# EAGLE board M.2 SoM breakout board v0.2-Placement-03011 (EAGLE 9.6.2), part 1 of 2
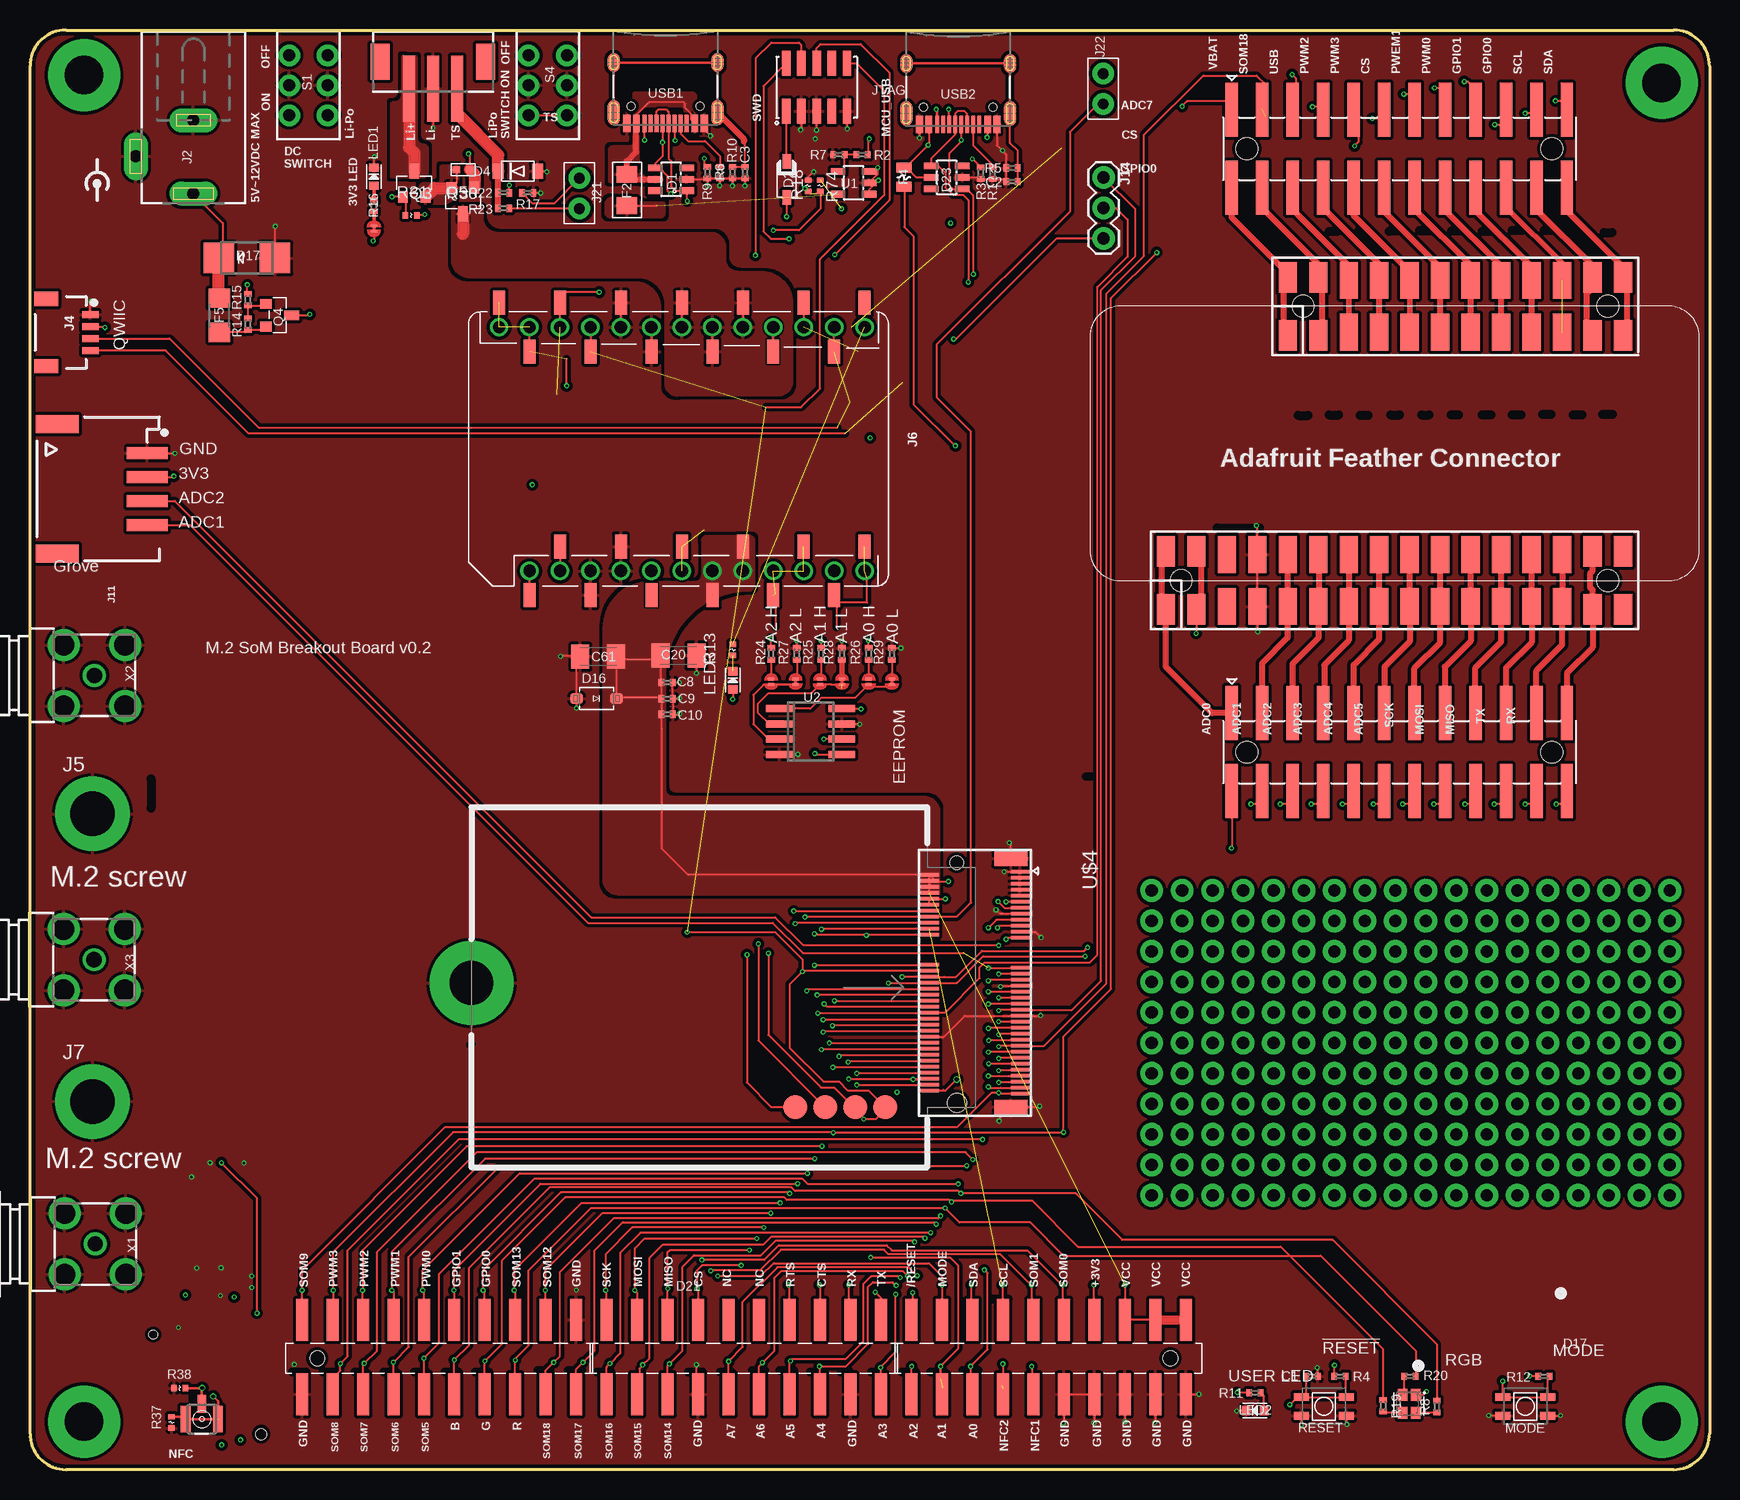
[diagram p3: board, top side]
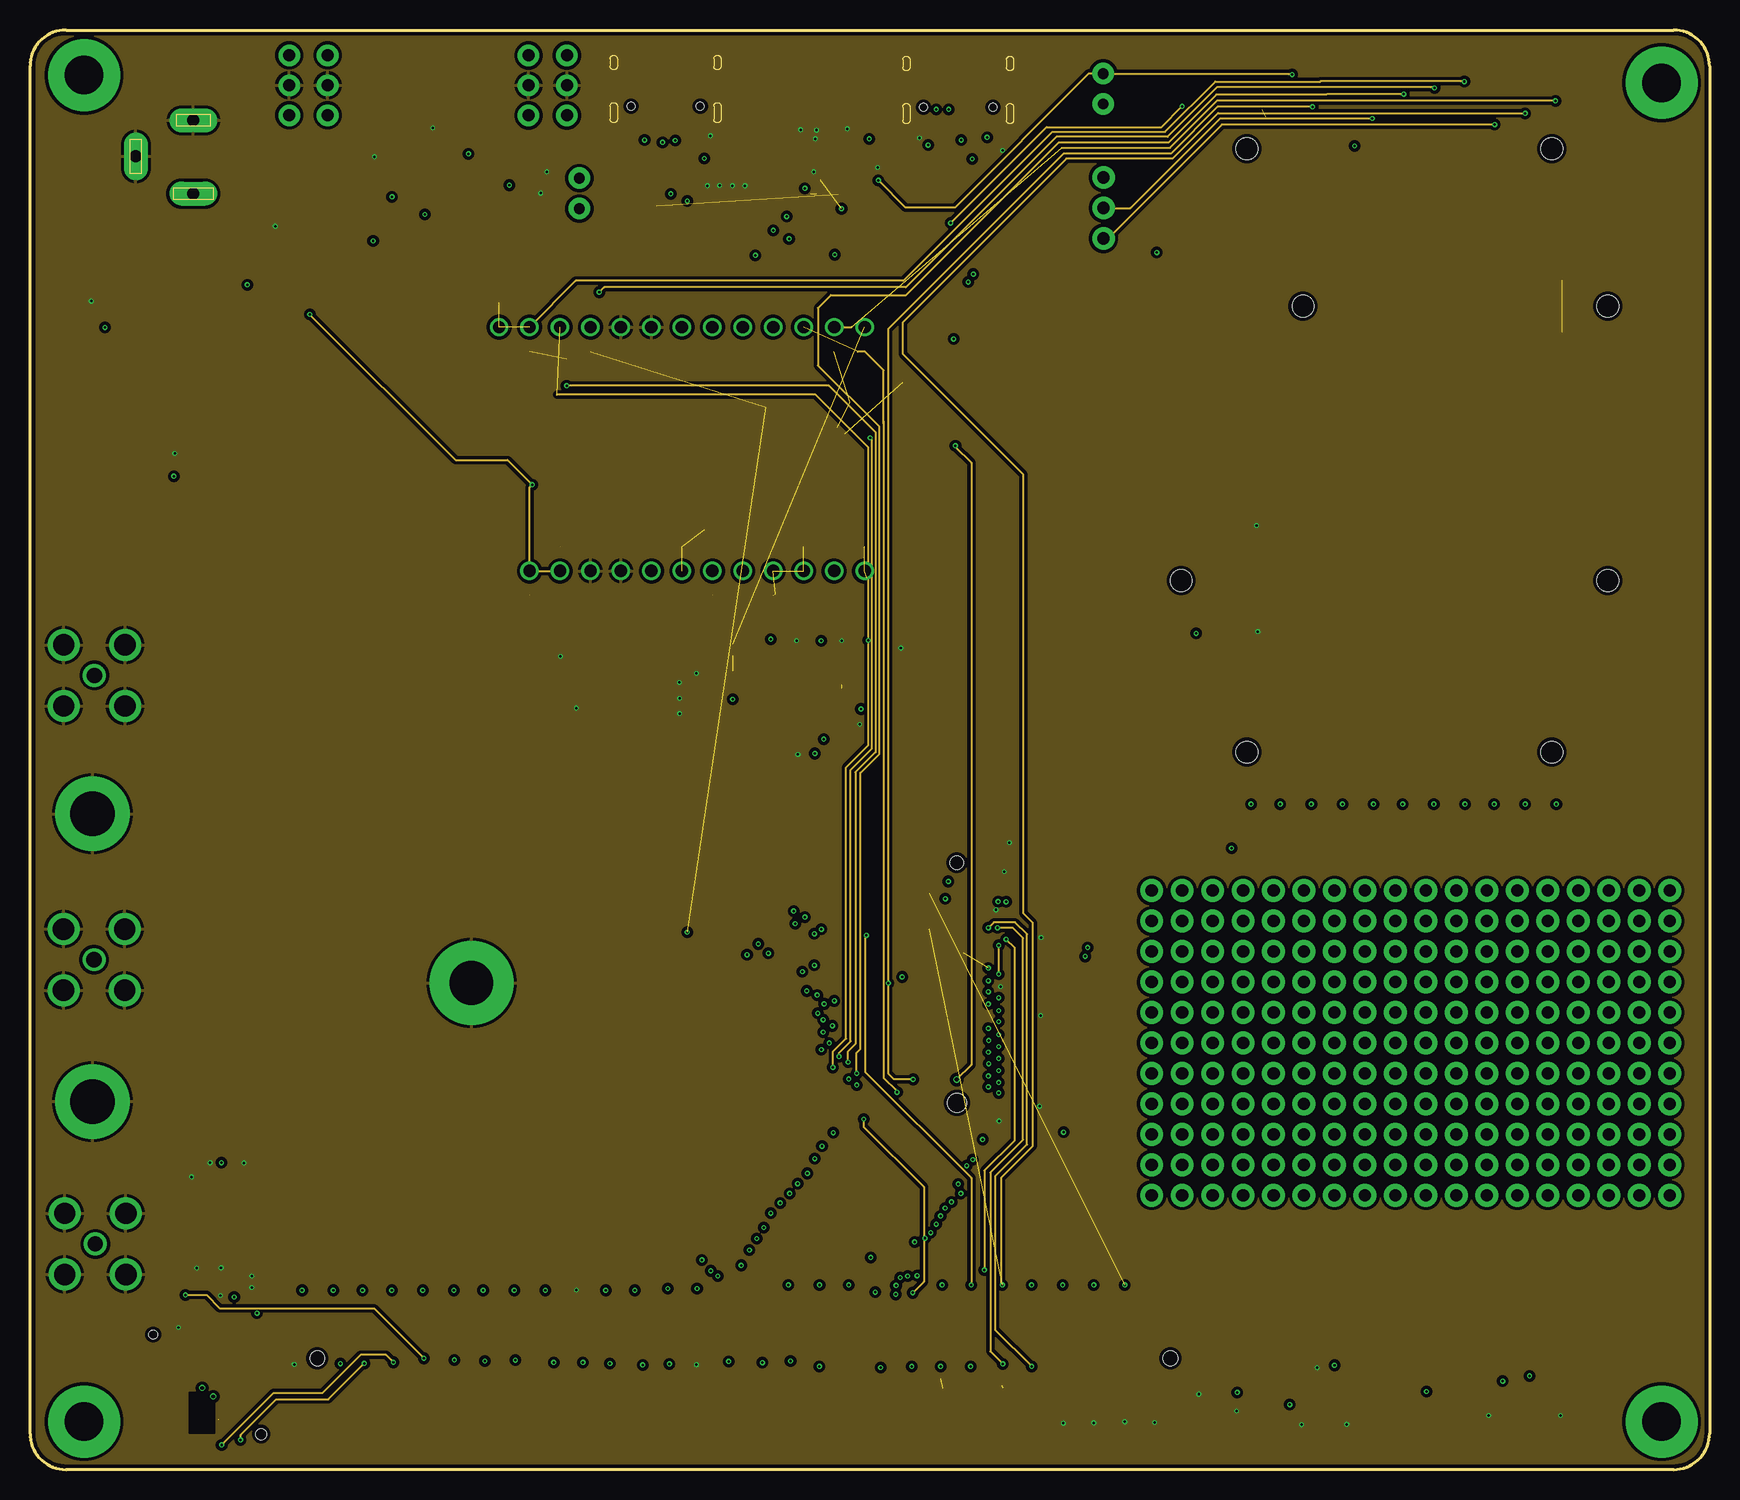
[diagram p4: board, inner layer GND]
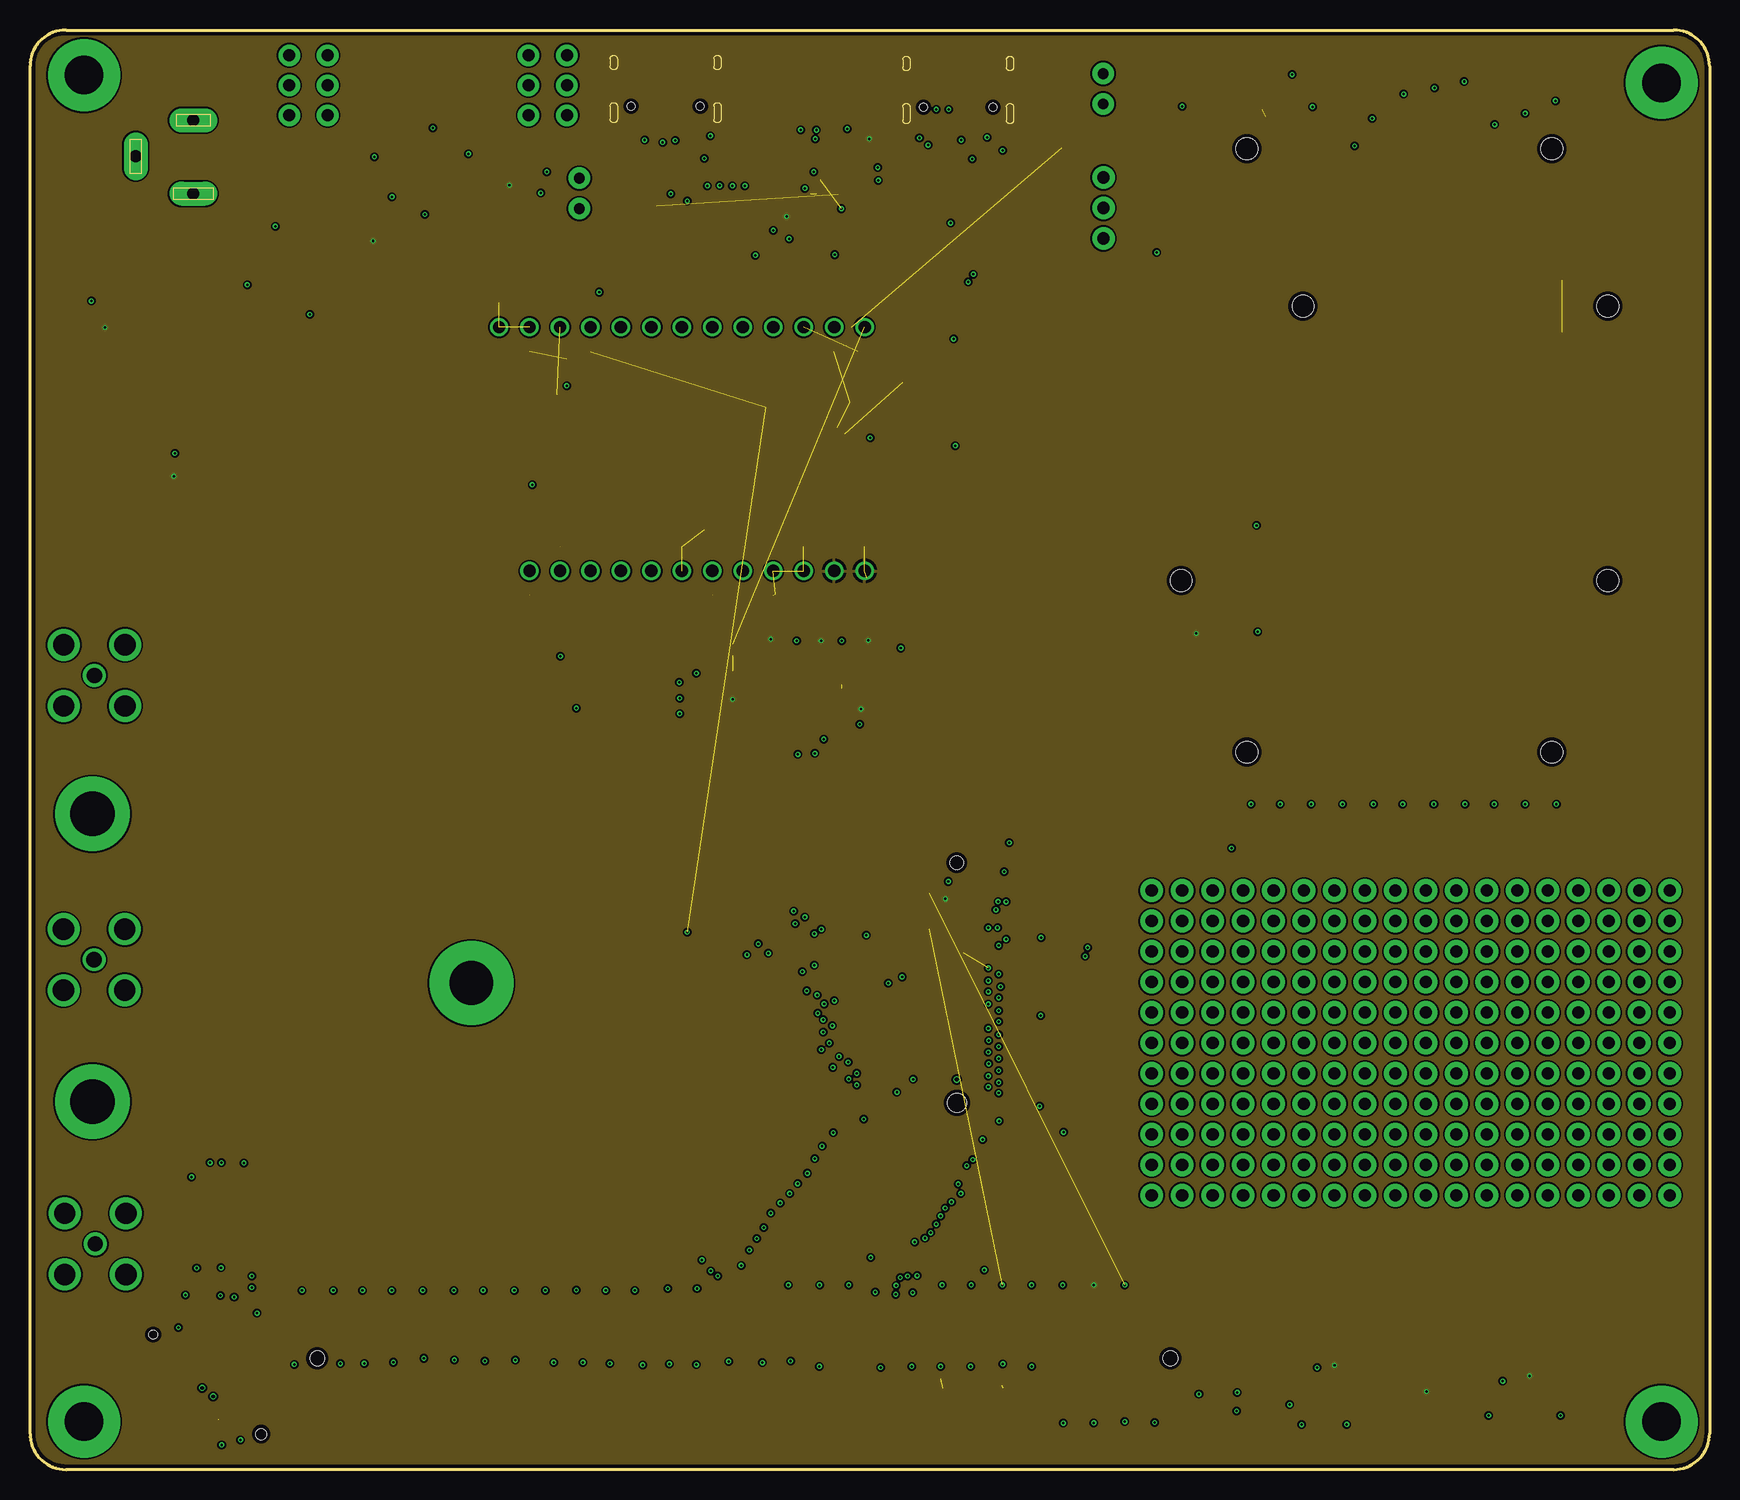
[diagram p5: board, inner layer Route15]
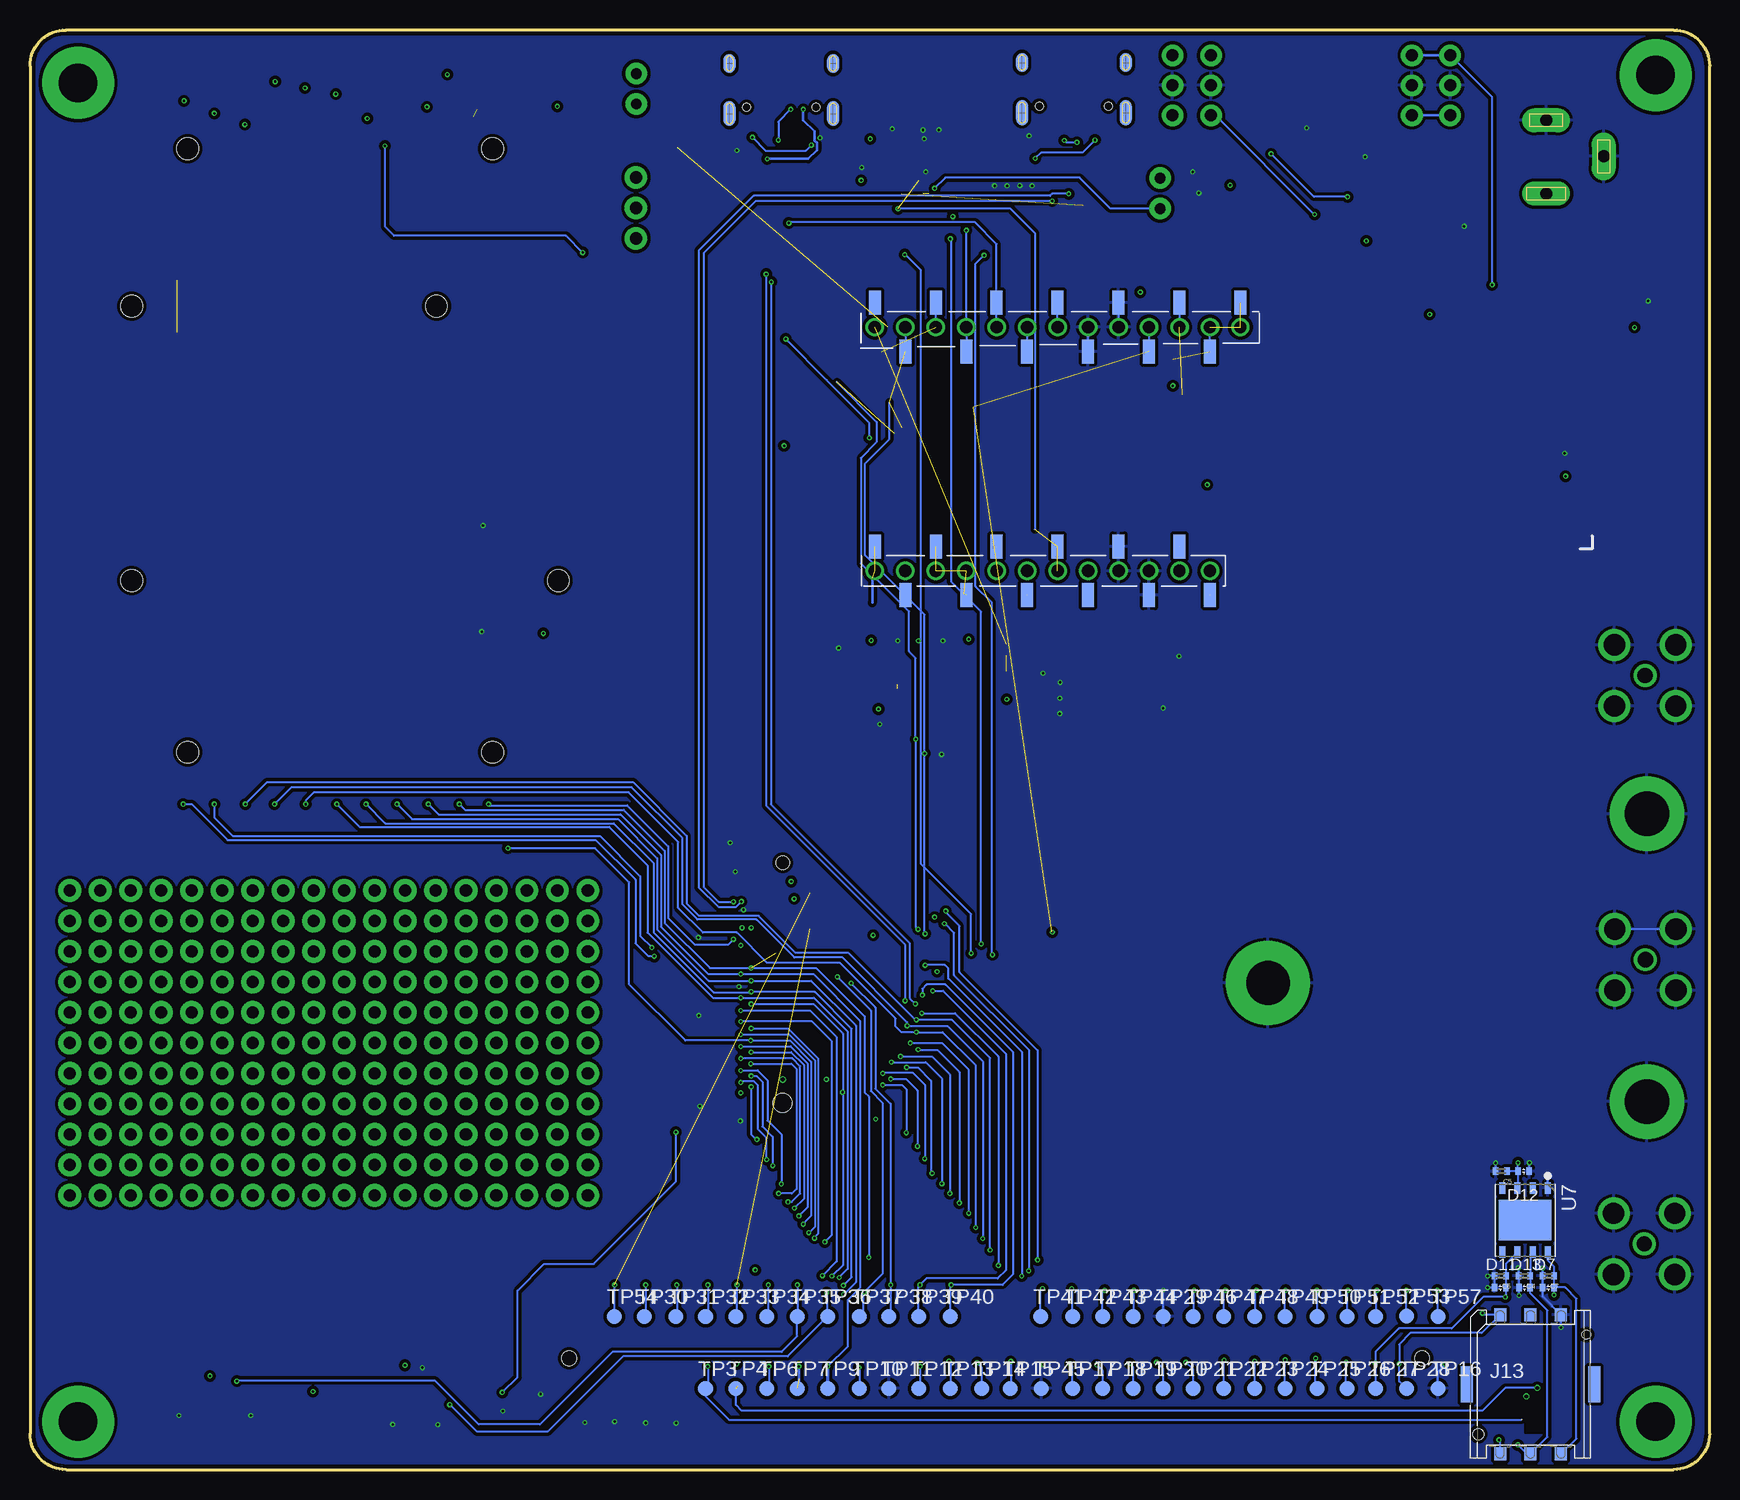
[diagram p6: board, bottom side, seen from below]

Size 140 x 120 mm. Coordinates in mm from the lower left corner, seen from the top.
Outline: 3,120 137,120 arc-90 140,117 140,3 arc-90 137,0 3,0 arc-90 0,3 0,117 arc-90 3,120
Copper layers (1+2*15+16): Top 0.035mm / dielectric 1.5mm / GND 0.035mm / dielectric 0.15mm / Route15 0.035mm / dielectric 0.2mm / Bottom 0.035mm
Design rules "default *": minimum track width 6mil, minimum drill 0.1mm, track to track 6mil, track to pad 6mil, pad to pad 6mil, via to via 6mil, smd to smd 6mil, copper to edge 12mil, drill to drill 6mil, minimum pad ring 4mil, minimum via ring 4mil, stop-mask expansion 4mil, vias tented up to drill 0.35mm, thermal gap 10mil
Net classes: 0 default: width 0.152 mm, clearance 0.152 mm; 1 power: width 0.254 mm, drill 0.61 mm, clearance 0.203 mm; 2 120R_Impedance: width 0.152 mm; 3 BAT: clearance 0.203 mm
tKeepout: 1 lines
tRestrict: 57 lines

## Footprints (pad centres in the part's own frame; a part is rotated, then mirrored left to right if it is on the bottom)
C0402_B = smd 0.457 x 0.61: 1 -0.483,0; 2 0.483,0
C1206K = smd 1.5 x 2: 1 -1.5,0; 2 1.5,0
SOT23-6 = smd 0.55 x 1.2: 1 -0.95,-1.3; 2 0,-1.3; 3 0.95,-1.3; 4 0.95,1.3; 5 0,1.3; 6 -0.95,1.3
SOD-123 = smd 1.2 x 0.7: 1 -1.5,0; 2 1.5,0
SOD-123FL = smd 0.91 x 1.22: A 1.637,0; C -1.637,0
C0402 = smd 0.45 x 0.6: 1 -0.47,0; 2 0.47,0
SOD-123' = smd 1.02 x 0.86: A 1.68,0; C -1.68,0
SMADIODE = smd 2.54 x 2.54: A 2.349,0; C -2.349,0
R1206 = smd 1.4 x 1.7: 1 -1.3,0; 2 1.3,0
F0805 = smd 0.85 x 1.25: P$1 -0.8,0; P$2 0.8,0
R1206' = smd 1.6 x 1.803: 1 -1.422,0; 2 1.422,0
JST-3-SMD-VERT = smd 1 x 5.5: 1 -2,0; 2 0,0; 3 2,0 | smd 1.6 x 3: PAD1 -4.4,-2.25; PAD2 4.4,-2.25
DCJ0202 = drill 1 pad 2 long: 1 0,3.1; 2 4.8,0; 3 0,-3
SPARK_CON_30X2_SMD = smd 1 x 3.5: 1 0,3.013; 2 0,-3.213; 3 2.54,3.013; 4 2.54,-3.213; 5 5.08,3.013; 6 5.08,-3.213; 7 7.62,3.013; 8 7.62,-3.213; 9 10.16,3.013; 10 10.16,-3.213; 11 12.7,3.013; 12 12.7,-3.213; 13 15.24,3.013; 14 15.24,-3.213; 15 17.78,3.013; 16 17.78,-3.213; 17 20.32,3.013; 18 20.32,-3.213; 19 22.86,3.013; 20 22.86,-3.213; 21 25.4,3.013; 22 25.4,-3.213; 23 27.94,3.013; 24 27.94,-3.213; 25 30.48,3.013; 26 30.48,-3.213; 27 33.02,3.013; 28 33.02,-3.213; 29 35.56,3.013; 30 35.56,-3.213; 31 38.1,3.013; 32 38.1,-3.213; 33 40.64,3.013; 34 40.64,-3.213; 35 43.18,3.013; 36 43.18,-3.213; 37 45.72,3.013; 38 45.72,-3.213; 39 48.26,3.013; 40 48.26,-3.213; 41 50.8,3.013; 42 50.8,-3.213; 43 53.34,3.013; 44 53.34,-3.213; 45 55.88,3.013; 46 55.88,-3.213; 47 58.42,3.013; 48 58.42,-3.213; 49 60.96,3.013; 50 60.96,-3.213; 51 63.5,3.013; 52 63.5,-3.213; 53 66.04,3.013; 54 66.04,-3.213; 55 68.58,3.013; 56 68.58,-3.213; 57 71.12,3.013; 58 71.12,-3.213; 59 73.66,3.013; 60 73.66,-3.213 | hole 1.2: 1.27,0; 72.39,0
1X04_1MM_RA = smd 0.6 x 1.35: 1 -1.5,0; 2 -0.5,0; 3 0.5,0; 4 1.5,0 | smd 1.2 x 2: NC1 2.8,-3.675; NC2 -2.8,-3.675
SCREW-HOLE-3.7 = drill 3.7 pad 6.2: P$1 0,0
PARTICLE-SZ_PARTICLE-POWER-MODULE = smd 1 x 2 bottom: 1 5.08,-0.762; 2 7.62,3.302; 3 10.16,-0.762; 4 12.7,3.302; 5 15.24,-0.762; 6 17.78,3.302; 7 20.32,-0.762; 8 22.86,3.302; 9 25.4,-0.762; 10 27.94,3.302; 11 30.48,-0.762; 12 33.02,3.302; 13 33.02,23.622; 14 30.48,19.55; 15 27.94,23.622; 16 25.4,19.55; 17 22.86,23.622; 18 20.32,19.55; 19 17.78,23.622; 20 15.24,19.55; 21 12.7,23.622; 22 10.16,19.55; 23 7.62,23.622; 24 5.08,19.558; 25 2.54,23.622 | smd 1 x 2: @1 5.08,-0.762; @2 7.62,3.302; @3 10.16,-0.762; @4 12.7,3.302; @5 15.24,-0.762; @6 17.78,3.302; @7 20.32,-0.762; @8 22.86,3.302; @9 25.4,-0.762; @10 27.94,3.302; @11 30.48,-0.762; @12 33.02,3.302; @13 33.02,23.622; @14 30.48,19.55; @15 27.94,23.622; @16 25.4,19.55; @17 22.86,23.622; @18 20.32,19.55; @19 17.78,23.622; @20 15.24,19.55; @21 12.7,23.622; @22 10.16,19.55; @23 7.62,23.622; @24 5.08,19.558; @25 2.54,23.622 | drill 1.016 pad 1.524: P$1 5.08,1.27; P$2 7.62,1.27; P$3 10.16,1.27; P$4 12.7,1.27; P$5 15.24,1.27; P$6 17.78,1.27; P$7 20.32,1.27; P$8 22.86,1.27; P$9 25.4,1.27; P$10 27.94,1.27; P$11 30.48,1.27; P$12 33.02,1.27; P$13 33.02,21.59; P$14 30.48,21.59; P$15 27.94,21.59; P$16 25.4,21.59; P$17 22.86,21.59; P$18 20.32,21.59; P$19 17.78,21.59; P$20 15.24,21.59; P$21 12.7,21.59; P$22 10.16,21.59; P$23 7.62,21.59; P$24 5.08,21.59; P$25 2.54,21.59
CON_12*2_SMD_HEADER = smd 1.02 x 4.5: 1 0,0.65; 2 0,-5.85; 3 2.54,0.65; 4 2.54,-5.85; 5 5.08,0.65; 6 5.08,-5.85; 7 7.62,0.65; 8 7.62,-5.85; 9 10.16,0.65; 10 10.16,-5.85; 11 12.7,0.65; 12 12.7,-5.85; 13 15.24,0.65; 14 15.24,-5.85; 15 17.78,0.65; 16 17.78,-5.85; 17 20.32,0.65; 18 20.32,-5.85; 19 22.86,0.65; 20 22.86,-5.85; 21 25.4,0.65; 22 25.4,-5.85; 23 27.94,0.65; 24 27.94,-5.85 | hole 1.8: 1.27,-2.6; 26.67,-2.6
WAFER-HY2.0-4PWB = smd 1 x 3.4: 1 -3,3.75; 2 -1,3.75; 3 1,3.75; 4 3,3.75 | smd 1.5 x 3.6: NC1 5.4,-3.75; NC2 -5.4,-3.75
TP_OPEN = smd 0.2 x 0.5: 1 -0.21,0; 2 0.21,0
GCT-SIM8100 = smd 1 x 1.1: C1 2.54,-5.8; C2 0,-5.8; C3 -2.54,-5.8; C5 2.54,5.8; C6 0,5.8; C7 -2.54,5.8 | smd 1 x 3: NC@1 -5.3,0; NC@2 5.3,0 | hole 0.7: 4.65,4.15 | hole 0.9: -4.35,-4.15
1X03 = drill 1.016 pad 1.88: 1 0,0; 2 2.54,0; 3 5.08,0
SIP-2 = drill 0.9 pad 1.8: 1 -1.27,0; 2 1.27,0
CONN5X2_1.27 = smd 0.7 x 2.1: 1 -2.54,-2; 2 -2.54,2; 3 -1.27,-2; 4 -1.27,2; 5 0,-2; 6 0,2; 7 1.27,-2; 8 1.27,2; 9 2.54,-2; 10 2.54,2
LED0603 = smd 0.7 x 0.8: 1 -0.75,0; 2 0.75,0
TACTILE_SWITCH_SMD = smd 1.25 x 0.65: 1 -1.875,0.775; 2 1.875,0.775; 3 -1.875,-0.775; 4 1.875,-0.775
FEATHERWING_SMT2 = smd 1.524 x 2.54: 1 6.35,2.413; 1' 6.35,-2.413; 2 8.89,2.413; 2' 8.89,-2.413; 15 41.91,2.413; 15' 41.91,-2.413; 16 44.45,2.413; 16' 44.45,-2.413; 17 44.45,20.447; 17' 44.45,25.273; 18 41.91,20.447; 18' 41.91,25.273; 27 19.05,20.447; 27' 19.05,25.273; 28 16.51,20.447; 28' 16.51,25.273 | smd 1.524 x 3.048: 3 11.43,2.159; 3' 11.43,-2.159; 4 13.97,2.159; 4' 13.97,-2.159; 5 16.51,2.159; 5' 16.51,-2.159; 6 19.05,2.159; 6' 19.05,-2.159; 7 21.59,2.159; 7' 21.59,-2.159; 8 24.13,2.159; 8' 24.13,-2.159; 9 26.67,2.159; 9' 26.67,-2.159; 10 29.21,2.159; 10' 29.21,-2.159; 11 31.75,2.159; 11' 31.75,-2.159; 12 34.29,2.159; 12' 34.29,-2.159; 13 36.83,2.159; 13' 36.83,-2.159; 14 39.37,2.159; 14' 39.37,-2.159; 19 39.37,20.701; 19' 39.37,25.019; 20 36.83,20.701; 20' 36.83,25.019; 21 34.29,20.701; 21' 34.29,25.019; 22 31.75,20.701; 22' 31.75,25.019; 23 29.21,20.701; 23' 29.21,25.019; 24 26.67,20.701; 24' 26.67,25.019; 25 24.13,20.701; 25' 24.13,25.019; 26 21.59,20.701; 26' 21.59,25.019 | hole 1.8: 17.78,22.86; 43.18,22.86; 7.62,0; 43.18,0
IPEX-20279-001E = smd 0.73 x 1.5: 1 0,1.28 | smd 0.8 x 2.2: 2@1 -1.35,0; 2@2 1.35,0
SOT-23 = smd 0.8 x 0.95: 1 -0.95,-1; 2 0.95,-1 | smd 0.8 x 1.25: 3 0,1.15
R0402_B = smd 0.457 x 0.61: 1 -0.483,0; 2 0.483,0
R-0402S = smd 0.45 x 0.55: 1 -0.47,0; 2 0.47,0
R0603 = smd 0.6 x 0.6: 1 -0.55,0; 2 0.55,0
PLCC4-2MM-RGB = smd 1 x 0.8: BLUE -0.75,-0.55; CA 0.75,-0.55; GREEN -0.75,0.55; RED 0.75,0.55
SWITCH-2.5X3.2-6 = drill 1 pad 1.8: 1 0,0; 2 0,2.5; 3 0,5; 4 3.2,0; 5 3.2,2.5; 6 3.2,5
TP_SHORT = smd 0.2 x 0.5: 1 -0.21,0; 2 0.21,0
B1,27 = smd 1.27 x 1.27: TP 0,0
SOT25 = smd 0.55 x 1.2: 1 -0.95,-1.3; 2 0,-1.3; 3 0.95,-1.3; 4 0.95,1.3; 5 -0.95,1.3
SO-08 = smd 0.6 x 2.2: 1 -1.905,-2.6; 2 -0.635,-2.6; 3 0.635,-2.6; 4 1.905,-2.6; 5 1.905,2.6; 6 0.635,2.6; 7 -0.635,2.6; 8 -1.905,2.6
MFF2 = smd 0.96 x 0.5: 1 -2.675,1.905; 2 -2.675,0.635; 3 -2.675,-0.635; 4 -2.675,-1.905; 5 2.675,-1.905; 6 2.675,-0.635; 7 2.675,0.635; 8 2.675,1.905 | smd 3.4 x 4.4: P$1 0,0
PARTICLE-STUDIOS_PARTICLE_M.2EKEY_3.65MM_DRILL = smd 0.3 x 1.55: 1 -9.62,3.735; 2 -9.37,-3.815; 3 -9.12,3.735; 4 -8.87,-3.815; 5 -8.62,3.735; 6 -8.37,-3.815; 7 -8.12,3.735; 8 -7.87,-3.815; 9 -7.62,3.735; 10 -7.37,-3.815; 11 -7.12,3.735; 12 -6.87,-3.815; 13 -6.62,3.735; 14 -6.37,-3.815; 15 -6.12,3.735; 16 -5.87,-3.815; 17 -5.62,3.735; 18 -5.37,-3.815; 19 -5.12,3.735; 20 -4.87,-3.815; 21 -4.62,3.735; 22 -4.37,-3.815; 23 -4.12,3.735; 32 -1.87,-3.815; 33 -1.62,3.735; 34 -1.37,-3.815; 35 -1.12,3.735; 36 -0.87,-3.815; 37 -0.62,3.735; 38 -0.37,-3.815; 39 -0.12,3.735; 40 0.13,-3.815; 41 0.38,3.735; 42 0.63,-3.815; 43 0.88,3.735; 44 1.13,-3.815; 45 1.38,3.735; 46 1.63,-3.815; 47 1.88,3.735; 48 2.13,-3.815; 49 2.38,3.735; 50 2.63,-3.815; 51 2.88,3.735; 52 3.13,-3.815; 53 3.38,3.735; 54 3.63,-3.815; 55 3.88,3.735; 56 4.13,-3.815; 57 4.38,3.735; 58 4.63,-3.815; 59 4.88,3.735; 60 5.13,-3.815; 61 5.38,3.735; 62 5.63,-3.815; 63 5.88,3.735; 64 6.13,-3.815; 65 6.38,3.735; 66 6.63,-3.815; 67 6.88,3.735; 68 7.13,-3.815; 69 7.38,3.735; 70 7.63,-3.815; 71 7.88,3.735; 72 8.13,-3.815; 73 8.38,3.735; 74 8.63,-3.815; 75 8.88,3.735 | smd 1.2 x 2.75: 76 9.98,2.96; 77 -10.72,2.96 | drill 3.65 pad 7: 78 -0.351,-42 | smd 2 x 2: !RESET 10,-7.5; SWCLK 10,-15; SWDIO 10,-12.5; SWO 10,-10 | hole 1.1: -10.37,-1.54 | hole 1.55: 9.63,-1.54
USB-C-16P = smd 0.3 x 1.45: A5 -1.25,0; A6 -0.25,0; A7 0.25,0; A8 1.25,0; B5 1.75,0; B6 0.75,0; B7 -0.75,0; B8 -1.75,0 | smd 0.6 x 1.45: GND -3.225,0; GND2 3.225,0 | smd 1 x 2.1: SHLD1 -4.32,-0.915; SHLD2 4.32,-0.915 | smd 1 x 2.1 bottom: SHLD3 -4.32,-0.915; SHLD4 4.32,-0.915 | smd 1 x 1.6: SHLD5 -4.32,-5.095; SHLD8 4.32,-5.095 | smd 1 x 1.6 bottom: SHLD6 -4.32,-5.095; SHLD7 4.32,-5.095 | smd 0.55 x 1.45: VBUS1 -2.45,0; VBUS2 2.45,0 | hole 0.65: -2.89,-1.445; 2.89,-1.445
BU-SMA-G = drill 1.27: 1 0,0 | drill 1.778: 2 -2.55,2.55; 3 2.55,2.55; 4 2.55,-2.55; 5 -2.55,-2.55

## Placement (x,y rotation side)
C1  0.1uF  [C0402_B]  106.88,7.78 0 top
C2  0.1uF  [C0402_B]  81.85,107.35 180 top
C3  0.1uF  [C0402_B]  59.61,108.11 270 top
C4  33pF  [C0402_B]  15.43,16.15 180 bottom
C5  33pF  [C0402_B]  17.35,24.87 180 bottom
C6  33pF  [C0402_B]  17.45,16.15 180 bottom
C7  0.1uF  [C0402_B]  13.43,16.15 180 bottom
C8  1nF  [C0402_B]  53.1,65.61 0 top
C9  100pF  [C0402_B]  53.11,64.26 0 top
C10  33pF  [C0402_B]  53.12,62.96 0 top
C20  100uF  [C1206K]  54.05,67.84 0 top
C61  100uF  [C1206K]  47.37,67.76 180 top
D1  TPESD0504S6  [SOT23-6]  53.44,107.55 90 top
D2  B5819w  [SOD-123]  63.07,107.54 90 top
D4  SMF3.3  [SOD-123FL]  40.67,108.23 0 top
D7  0402ESDA-05N  [C0402]  13.43,15.16 0 bottom
D11  0402ESDA-05N  [C0402]  17.45,15.16 0 bottom
D12  0402ESDA-05N  [C0402]  15.5,24.87 180 bottom
D13  0402ESDA-05N  [C0402]  15.42,15.16 0 bottom
D16  BZT52C3V9  [SOD-123']  47.23,64.27 180 top
D17  SMAJ15CA-13-F  [SMADIODE]  18.08,101 0 top
D23  DNP MAX3207EAUT+T  [SOT23-6]  76.42,107.7 90 top
F2  RF1512-000  [R1206]  49.76,106.67 270 top
F4  Fuse  [F0805]  72.84,107.73 90 top
F5  16V/0.75A  [R1206']  15.79,96.22 270 top
J1  [JST-3-SMD-VERT]  33.59,115.1 180 top
J2  DCJ0202  [DCJ0202]  13.62,109.46 180 top
J3  SPARK_CON_30X2_SMD  [SPARK_CON_30X2_SMD]  96.33,9.27 180 top
J4  [1X04_1MM_RA]  5.04,94.78 270 top
J5  SCREW-HOLE-3.7  [SCREW-HOLE-3.7]  5.21,54.66 0 top
J6  PARTICLE-SZ_PARTICLE-POWER-MODULE  [PARTICLE-SZ_PARTICLE-POWER-MODULE]  36.56,73.64 0 top
J7  SCREW-HOLE-3.7  [SCREW-HOLE-3.7]  5.21,30.68 0 top
J10  CON_122_SMD_HEADER  [CON_12*2_SMD_HEADER]  100.17,112.7 0 top
J11  WAFER-HY2.0-4PWB  [WAFER-HY2.0-4PWB]  6.02,81.74 270 top
J12  TP_OPEN  [TP_OPEN]  61.78,65.66 270 top
J13  SIM-NANO-4FF  [GCT-SIM8100]  14.92,7.11 0 bottom
J14  [1X03]  89.49,107.7 270 top
J15  CON_122_SMD_HEADER  [CON_12*2_SMD_HEADER]  100.17,62.4 0 top
J19  TP_OPEN  [TP_OPEN]  65.85,65.66 270 top
J20  TP_OPEN  [TP_OPEN]  69.91,65.66 270 top
J21  SIP-2  [SIP-2]  45.78,106.38 90 top
J22  SIP-2  [SIP-2]  89.46,115.09 90 top
JTAG  CONN5X2  [CONN5X2_1.27]  65.57,115.22 0 top
LED1  RED  [LED0603]  28.67,107.77 90 top
LED2  BLUE  [LED0603]  102.11,4.91 180 top
LED3  yellow  [LED0603]  58.59,65.79 90 top
MODE  [TACTILE_SWITCH_SMD]  124.65,5.26 180 top
MS1  PARTICLE_MESH_SMTDUAL  [FEATHERWING_SMT2]  88.34,74.11 0 top
NFC  UFL  [IPEX-20279-001E]  14.33,4.2 0 top
Q3  IR6401  [SOT-23]  36.1,105.82 180 top
Q4  IRLML6401  [SOT-23]  20.66,96.22 270 top
Q5  IR6401  [SOT-23]  32.03,107.09 0 top
R1  5.1k  [R0402_B]  80.24,108.06 270 top
R2  1K  [R0402_B]  69.36,109.6 0 top
R3  5.1k  [R0402_B]  79.25,108.06 270 top
R4  10K  [R0402_B]  109.2,7.78 180 top
R5  1M  [R0402_B]  81.85,108.5 180 top
R6  5.1k  [R0402_B]  57.52,108.11 270 top
R7  1M  [R0402_B]  67.42,109.6 180 top
R8  1K  [R0402_B]  117.26,5.25 270 top
R9  5.1k  [R0402_B]  56.47,108.11 270 top
R10  1M  [R0402_B]  58.56,108.11 270 top
R11  1K  [R0402_B]  102.11,6.4 180 top
R12  DNP  [R0402_B]  126.18,7.78 180 top
R13  1K  [R-0402S]  58.59,68.33 90 top
R14  100K  [R0402_B]  18.16,95.49 270 top
R15  1K  [R0402_B]  18.16,97.51 270 top
R16  1K  [R0402_B]  28.67,105.35 270 top
R17  10K  [R0402_B]  41.5,106.43 180 top
R18  nc  [R-0402S]  65.88,107.01 90 top
R19  1K  [R0402_B]  112.79,5.32 270 top
R20  1K  [R0402_B]  115.04,7.78 180 top
R22  1K  [R0402_B]  39.47,106.43 0 top
R23  0R  [R0402_B]  39.47,105.13 180 top
R24  10K  [R0402_B]  61.78,68 90 top
R25  10K  [R0402_B]  65.95,68 90 top
R26  10K  [R0402_B]  69.91,68 90 top
R27  100K  [R0402_B]  63.92,68 90 top
R28  100K  [R0402_B]  67.68,68 90 top
R29  100K  [R0402_B]  71.84,68 90 top
R30  100K  [R0603]  36.1,108.36 180 top
R31  1K  [R-0402S]  31.78,104.55 0 top
R37  ESD NC  [R-0402S]  11.8,3.92 270 top
R38  ESD NC  [R-0402S]  12.48,6.78 0 top
R74  nc  [R-0402S]  64.87,107.01 270 top
RESET  [TACTILE_SWITCH_SMD]  107.86,5.26 180 top
RGB  RGB-LED-CLMVB-FKARGB  [PLCC4-2MM-RGB]  114.95,5.47 90 top
S1  [SWITCH-2.5X3.2-6]  21.61,112.89 0 top
S4  [SWITCH-2.5X3.2-6]  44.76,117.89 180 top
T1  TP_SHORT  [TP_SHORT]  28.67,103.44 90 top
TP3  TPSB1,27  [B1,27]  83.69,6.76 0 bottom
TP4  TPSB1,27  [B1,27]  81.16,6.76 0 bottom
TP6  TPSB1,27  [B1,27]  78.59,6.76 0 bottom
TP7  TPSB1,27  [B1,27]  76.04,6.76 0 bottom
TP9  TPSB1,27  [B1,27]  73.5,6.76 0 bottom
TP10  TPSB1,27  [B1,27]  70.87,6.76 0 bottom
TP11  TPSB1,27  [B1,27]  68.4,6.76 0 bottom
TP12  TPSB1,27  [B1,27]  65.92,6.76 0 bottom
TP13  TPSB1,27  [B1,27]  63.3,6.76 0 bottom
TP14  TPSB1,27  [B1,27]  60.66,6.76 0 bottom
TP15  TPSB1,27  [B1,27]  58.29,6.76 0 bottom
TP16  TPSB1,27  [B1,27]  22.64,6.76 0 bottom
TP17  TPSB1,27  [B1,27]  53.08,6.76 0 bottom
TP18  TPSB1,27  [B1,27]  50.58,6.76 0 bottom
TP19  TPSB1,27  [B1,27]  48.03,6.76 0 bottom
TP20  TPSB1,27  [B1,27]  45.52,6.76 0 bottom
TP21  TPSB1,27  [B1,27]  43.03,6.76 0 bottom
TP22  TPSB1,27  [B1,27]  40.49,6.76 0 bottom
TP23  TPSB1,27  [B1,27]  37.91,6.76 0 bottom
TP24  TPSB1,27  [B1,27]  35.38,6.76 0 bottom
TP25  TPSB1,27  [B1,27]  32.69,6.76 0 bottom
TP26  TPSB1,27  [B1,27]  30.2,6.76 0 bottom
TP27  TPSB1,27  [B1,27]  27.81,6.76 0 bottom
TP28  TPSB1,27  [B1,27]  25.25,6.76 0 bottom
TP29  TPSB1,27  [B1,27]  45.52,12.77 0 bottom
TP30  TPSB1,27  [B1,27]  88.8,12.77 0 bottom
TP31  TPSB1,27  [B1,27]  86.15,12.77 0 bottom
TP32  TPSB1,27  [B1,27]  83.69,12.77 0 bottom
TP33  TPSB1,27  [B1,27]  81.16,12.77 0 bottom
TP34  TPSB1,27  [B1,27]  78.59,12.77 0 bottom
TP35  TPSB1,27  [B1,27]  76.04,12.77 0 bottom
TP36  TPSB1,27  [B1,27]  73.5,12.77 0 bottom
TP37  TPSB1,27  [B1,27]  70.87,12.77 0 bottom
TP38  TPSB1,27  [B1,27]  68.4,12.77 0 bottom
TP39  TPSB1,27  [B1,27]  65.92,12.77 0 bottom
TP40  TPSB1,27  [B1,27]  63.3,12.77 0 bottom
TP41  TPSB1,27  [B1,27]  55.75,12.77 0 bottom
TP42  TPSB1,27  [B1,27]  53.08,12.77 0 bottom
TP43  TPSB1,27  [B1,27]  50.58,12.77 0 bottom
TP44  TPSB1,27  [B1,27]  48.03,12.77 0 bottom
TP45  TPSB1,27  [B1,27]  55.7,6.76 0 bottom
TP46  TPSB1,27  [B1,27]  43.03,12.77 0 bottom
TP47  TPSB1,27  [B1,27]  40.49,12.77 0 bottom
TP48  TPSB1,27  [B1,27]  37.91,12.77 0 bottom
TP49  TPSB1,27  [B1,27]  35.38,12.77 0 bottom
TP50  TPSB1,27  [B1,27]  32.69,12.77 0 bottom
TP51  TPSB1,27  [B1,27]  30.2,12.77 0 bottom
TP52  TPSB1,27  [B1,27]  27.81,12.77 0 bottom
TP53  TPSB1,27  [B1,27]  25.25,12.81 0 bottom
TP54  TPSB1,27  [B1,27]  91.3,12.77 0 bottom
TP57  TPSB1,27  [B1,27]  22.64,12.77 0 bottom
U1  XC8107  [SOT25]  68.65,107.26 90 top
U2  AT24CS64-SSHM-B  [SO-08]  65.07,61.52 270 top
U7  NC  [MFF2]  15.37,20.79 270 bottom
U$2  TP_SHORT  [TP_SHORT]  63.82,65.66 270 top
U$3  TP_SHORT  [TP_SHORT]  67.68,65.66 270 top
U$4  PARTICLE-STUDIOS_M_SERIES_M.2KEY  [PARTICLE-STUDIOS_PARTICLE_M.2EKEY_3.65MM_DRILL]  78.8,40.2 270 top
U$6  PARTICLE-LOGO  [PARTICLE-LOGO]  16.37,72.5 0 top
U$7  TP_SHORT  [TP_SHORT]  71.84,65.66 270 top
USB1  [USB-C-16P]  52.98,112.19 180 top
USB2  [USB-C-16P]  77.37,112.12 180 top
X1  BU-SMA-G  [BU-SMA-G]  5.44,18.81 180 top
X2  BU-SMA-G  [BU-SMA-G]  5.37,66.19 180 top
X3  BU-SMA-G  [BU-SMA-G]  5.34,42.5 180 top